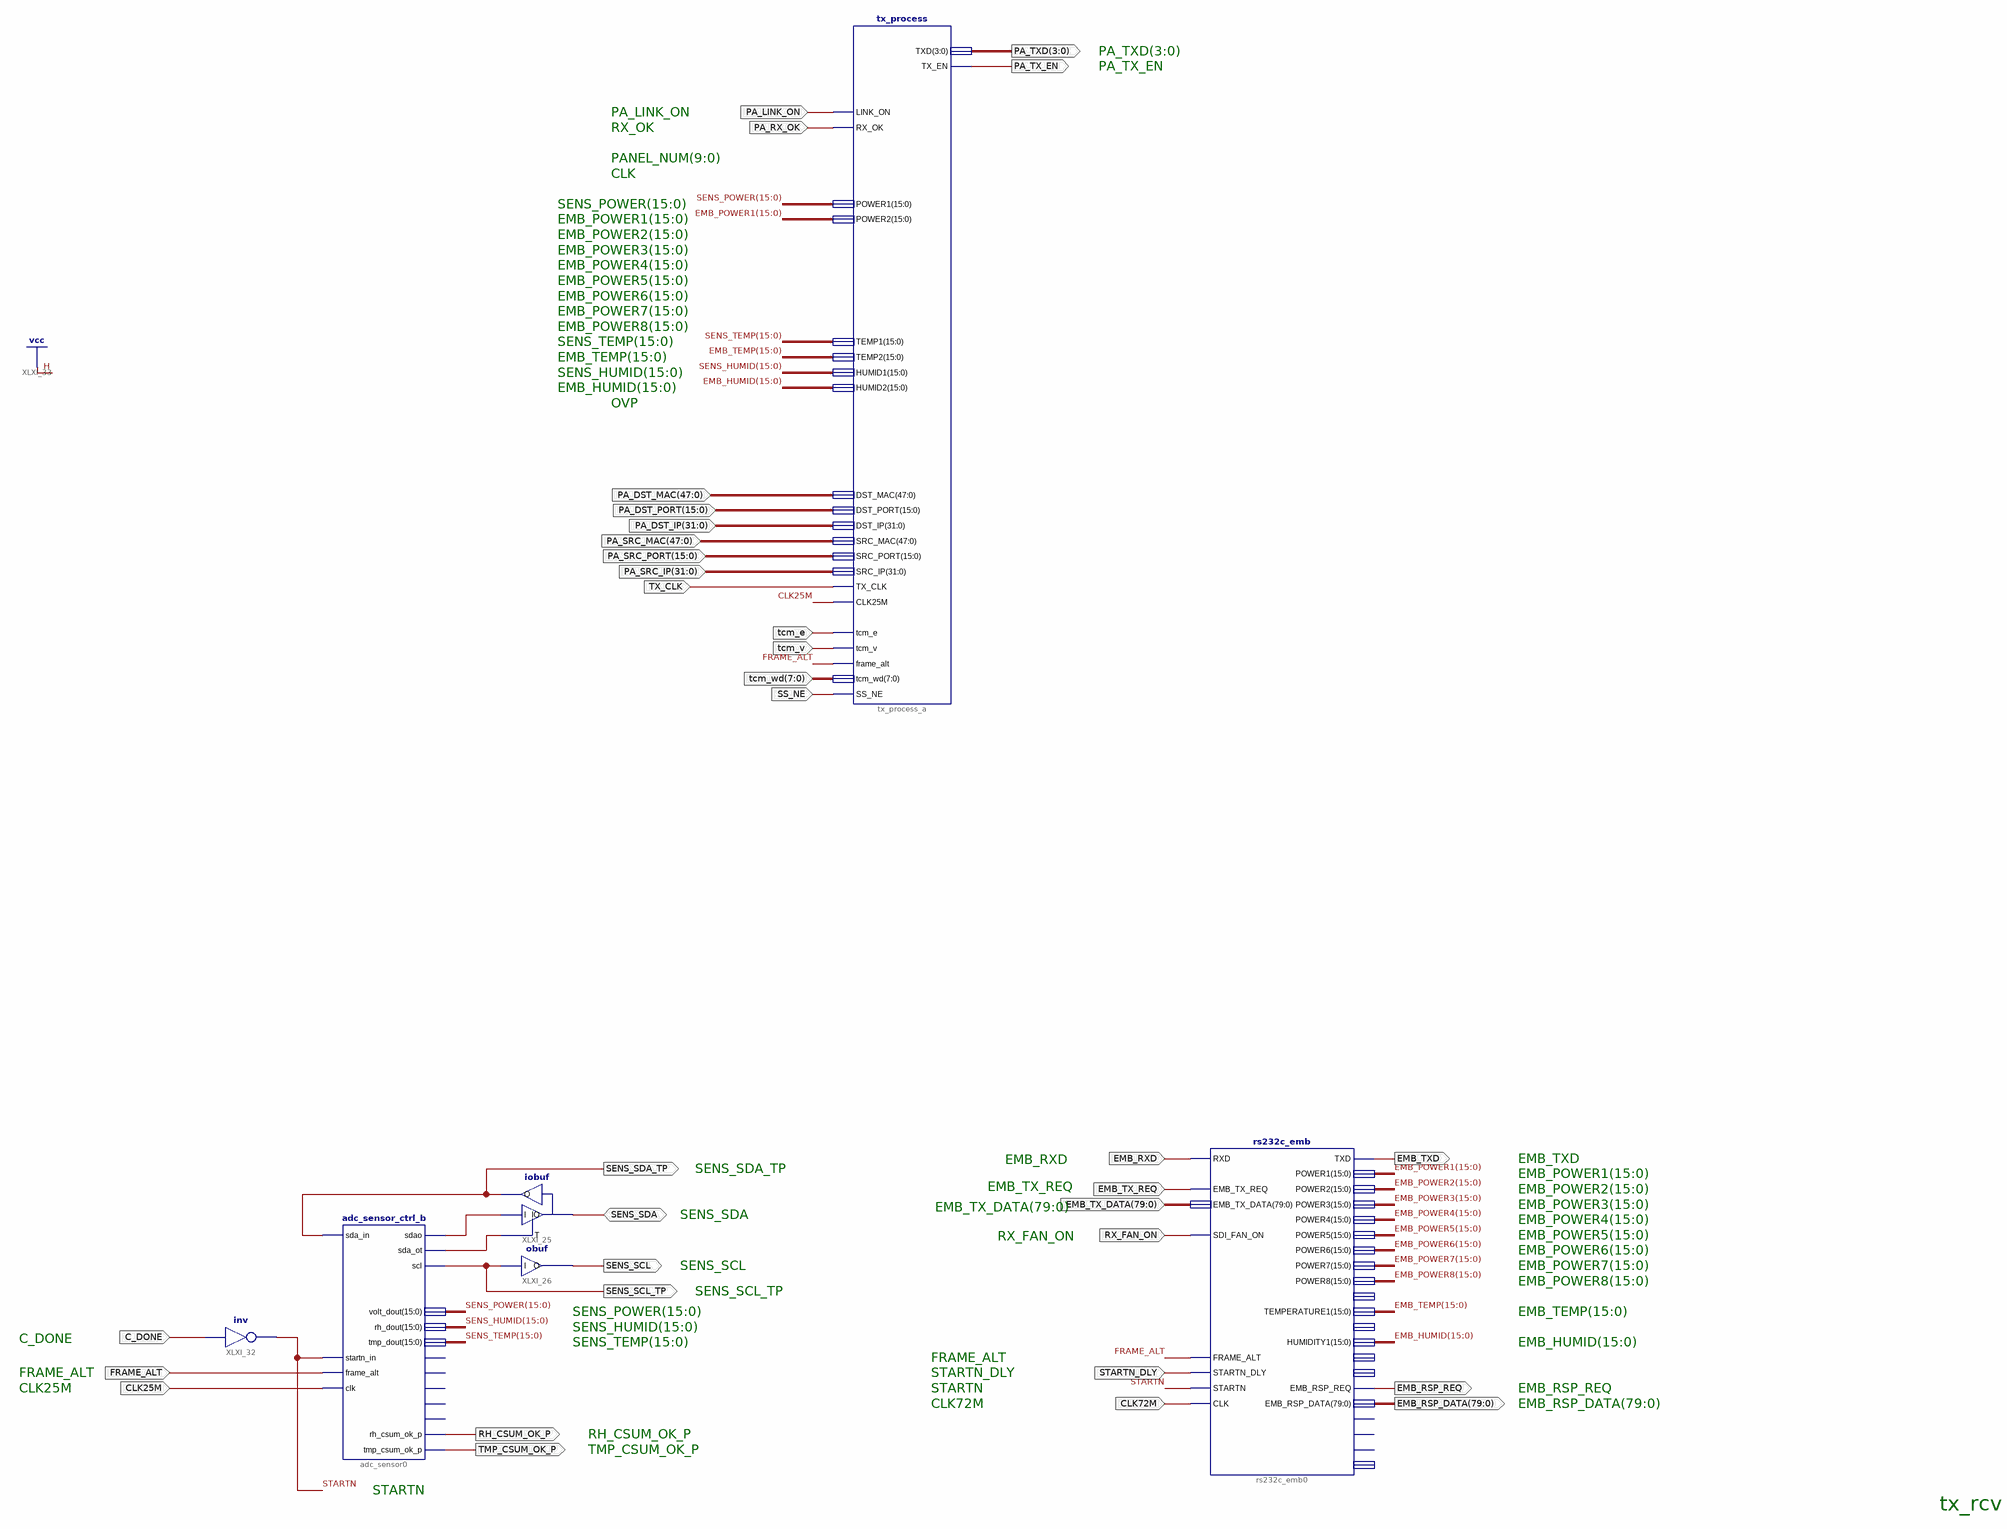
[diagram p0: schematic sheet 1]
// Xilinx ISE schematic tx_rcv.sch (aspartan6) as structural Verilog: 6 symbols, 33 ports
module tx_rcv (
  input  PA_LINK_ON,
  input  FRAME_ALT,
  input  C_DONE,
  input  CLK25M,
  input  [79:0] EMB_TX_DATA,
  input  EMB_RXD,
  input  EMB_TX_REQ,
  input  RX_FAN_ON,
  input  STARTN_DLY,
  input  CLK72M,
  input  [47:0] PA_DST_MAC,
  input  [15:0] PA_DST_PORT,
  input  [31:0] PA_DST_IP,
  input  [47:0] PA_SRC_MAC,
  input  [15:0] PA_SRC_PORT,
  input  [31:0] PA_SRC_IP,
  input  PA_RX_OK,
  input  TX_CLK,
  input  tcm_e,
  input  tcm_v,
  input  [7:0] tcm_wd,
  input  SS_NE,
  inout  SENS_SDA,
  output [3:0] PA_TXD,
  output PA_TX_EN,
  output SENS_SCL_TP,
  output SENS_SCL,
  output SENS_SDA_TP,
  output [79:0] EMB_RSP_DATA,
  output EMB_RSP_REQ,
  output EMB_TXD,
  output RH_CSUM_OK_P,
  output TMP_CSUM_OK_P
);

  wire STARTN, XLXN_86, XLXN_89;
  wire [15:0] EMB_HUMID, EMB_POWER1, EMB_POWER2, EMB_POWER3, EMB_POWER4, EMB_POWER5, EMB_POWER6, EMB_POWER7,
       EMB_POWER8, EMB_TEMP, SENS_HUMID, SENS_POWER, SENS_TEMP;

  tx_process tx_process_a (
    .LINK_ON(PA_LINK_ON), .TX_CLK(TX_CLK), .DST_MAC(PA_DST_MAC), .DST_PORT(PA_DST_PORT), .DST_IP(PA_DST_IP),
    .SRC_MAC(PA_SRC_MAC), .SRC_IP(PA_SRC_IP), .SRC_PORT(PA_SRC_PORT), .POWER1(SENS_POWER), .RX_OK(PA_RX_OK),
    .CLK25M(CLK25M), .TEMP1(SENS_TEMP), .TEMP2(EMB_TEMP), .HUMID1(SENS_HUMID), .HUMID2(EMB_HUMID),
    .tcm_e(tcm_e), .tcm_v(tcm_v), .frame_alt(FRAME_ALT), .POWER2(EMB_POWER1), .tcm_wd(tcm_wd),
    .TX_EN(PA_TX_EN), .TXD(PA_TXD), .SS_NE(SS_NE));
  obuf XLXI_26 (.I(SENS_SCL_TP), .O(SENS_SCL));
  iobuf XLXI_25 (.I(XLXN_86), .IO(SENS_SDA), .O(SENS_SDA_TP), .T(XLXN_89));
  not XLXI_32 (STARTN, C_DONE);
  rs232c_emb rs232c_emb0 (
    .CLK(CLK72M), .STARTN(STARTN), .EMB_TX_REQ(EMB_TX_REQ), .EMB_TX_DATA(EMB_TX_DATA), .FRAME_ALT(FRAME_ALT),
    .RXD(EMB_RXD), .STARTN_DLY(STARTN_DLY), .POWER1(EMB_POWER1), .POWER2(EMB_POWER2), .POWER3(EMB_POWER3),
    .POWER4(EMB_POWER4), .POWER5(EMB_POWER5), .POWER6(EMB_POWER6), .POWER7(EMB_POWER7), .POWER8(EMB_POWER8),
    .TEMPERATURE1(EMB_TEMP), .EMB_RSP_REQ(EMB_RSP_REQ), .EMB_RSP_DATA(EMB_RSP_DATA), .HUMIDITY1(EMB_HUMID),
    .TXD(EMB_TXD), .SDI_FAN_ON(RX_FAN_ON));  // open: EMB_BAUD_RATE, CMD_RX_REQ, CMD_TX_REQ, POWER9, TEMPERATURE2, HUMIDITY2, RXD_O, EMB_TP_OUT
  adc_sensor_ctrl_b adc_sensor0 (
    .startn_in(STARTN), .sda_in(SENS_SDA_TP), .frame_alt(FRAME_ALT), .clk(CLK25M), .scl(SENS_SCL_TP),
    .sda_ot(XLXN_89), .sdao(XLXN_86), .rh_csum_ok_p(RH_CSUM_OK_P), .tmp_csum_ok_p(TMP_CSUM_OK_P),
    .volt_dout(SENS_POWER), .rh_dout(SENS_HUMID), .tmp_dout(SENS_TEMP));  // open: cnt_rst, busy, adc_err_det, adc2_err_det, sens_err_det

  // Notes on the sheet:
  //   PA_TXD(3:0)
  //   PA_TX_EN
  //   PA_LINK_ON
  //   RX_OK
  //   PANEL_NUM(9:0)
  //   CLK
  //   SENS_POWER(15:0)
  //   EMB_POWER1(15:0)
  //   EMB_POWER2(15:0)
  //   EMB_POWER3(15:0)
  //   EMB_POWER4(15:0)
  //   EMB_POWER5(15:0)
  //   EMB_POWER6(15:0)
  //   EMB_POWER7(15:0)
  //   EMB_POWER8(15:0)
  //   SENS_TEMP(15:0)
  //   EMB_TEMP(15:0)
  //   SENS_HUMID(15:0)
  //   EMB_HUMID(15:0)
  //   OVP
  //   EMB_TXD
  //   EMB_RXD
  //   SENS_SDA_TP
  //   EMB_POWER1(15:0)
  //   EMB_TX_REQ
  //   EMB_POWER2(15:0)
  //   EMB_POWER3(15:0)
  //   EMB_TX_DATA(79:0)
  //   SENS_SDA
  //   EMB_POWER4(15:0)
  //   EMB_POWER5(15:0)
  //   RX_FAN_ON
  //   EMB_POWER6(15:0)
  //   SENS_SCL
  //   EMB_POWER7(15:0)
  //   EMB_POWER8(15:0)
  //   SENS_SCL_TP
  //   SENS_POWER(15:0)
  //   EMB_TEMP(15:0)
  //   SENS_HUMID(15:0)
  //   C_DONE
  //   SENS_TEMP(15:0)
  //   EMB_HUMID(15:0)
  //   FRAME_ALT
  //   FRAME_ALT
  //   STARTN_DLY
  //   CLK25M
  //   STARTN
  //   EMB_RSP_REQ
  //   CLK72M
  //   EMB_RSP_DATA(79:0)
  //   RH_CSUM_OK_P
  //   TMP_CSUM_OK_P
  //   STARTN
  //   tx_rcv
endmodule
